# Altium schematic sheet ZUM_Core.SchDoc: ZUM Core
size A4; Author: Andrés Gullón; DocumentNumber: 1; SheetNumber: 1; SheetTotal: 9
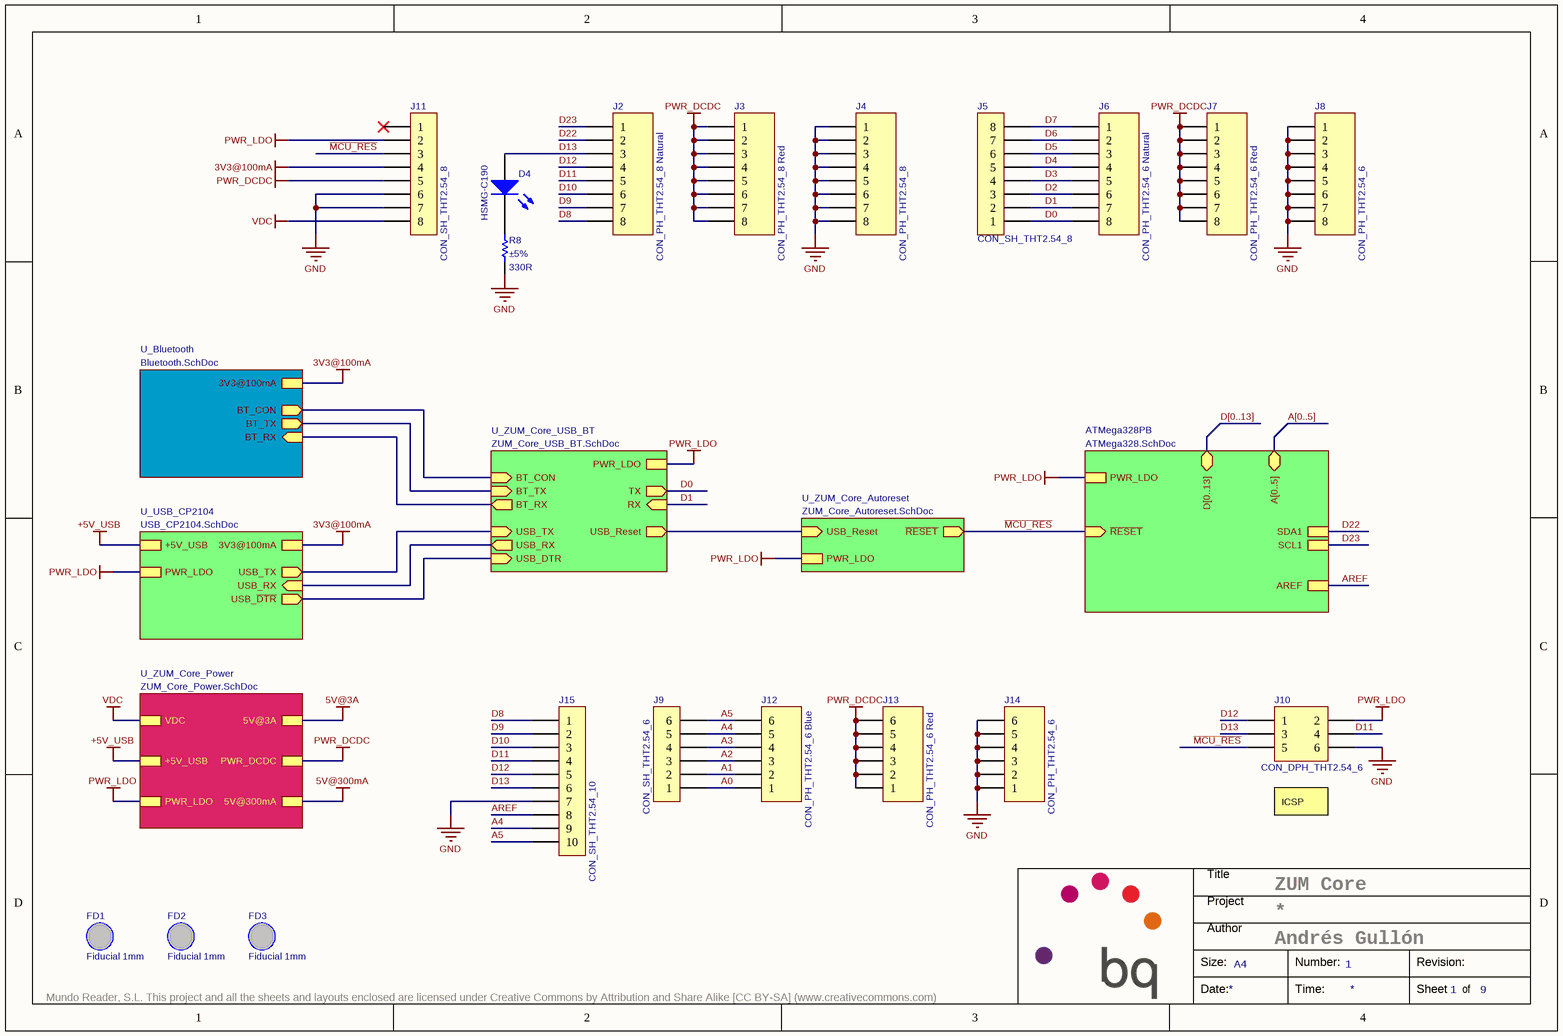
[diagram p0: ZUM_Core.SchDoc]

## Parts
D4  HSMG-C190  [LED0603]
FD1  Fiducial 1mm  [Fiducial_1mm]  (no BOM)
FD2  Fiducial 1mm  [Fiducial_1mm]  (no BOM)
FD3  Fiducial 1mm  [Fiducial_1mm]  (no BOM)
J2  CON_PH_THT2.54_8 Natural  [1x8 Pin Header 2.54]
J3  CON_PH_THT2.54_8 Red  [1x8 Pin Header 2.54]
J4  CON_PH_THT2.54_8  [1x8 Pin Header 2.54]
J5  CON_SH_THT2.54_8  [1x8 Socket Header THT 2.54mm]
J6  CON_PH_THT2.54_6 Natural  [1x8 Header 2.54 (3D Mod)]
J7  CON_PH_THT2.54_6 Red  [1x8 Header 2.54 (3D Mod)]
J8  CON_PH_THT2.54_6  [1x8 Header 2.54 (3D Mod)]
J9  CON_SH_THT2.54_6  [1x6 Socket Header THT 2.54mm]
J10  CON_DPH_THT2.54_6  [2x3 Pin Header 2.54]
J11  CON_SH_THT2.54_8  [1x8 Socket Header THT 2.54mm]
J12  CON_PH_THT2.54_6 Blue  [1x6 Pin Header 2.54]
J13  CON_PH_THT2.54_6 Red  [1x6 Pin Header 2.54]
J14  CON_PH_THT2.54_6  [1x6 Pin Header 2.54]
J15  CON_SH_THT2.54_10  [1x10 Socket Header THT 2.54mm]
R8  Tolerance: ±5%  Resistance: 330R  [R0402]  (hidden comment: R0402_330R_0.063W_±5%)

## Sub-sheets
ATMega328PB = ATMega328.SchDoc: D[0..13] (bidir), A[0..5] (bidir), ~{RESET} (in), PWR_LDO, AREF, SDA1, SCL1
U_Bluetooth = Bluetooth.SchDoc: 3V3@100mA, BT_TX (out), BT_RX (in), BT_CON (out)
U_USB_CP2104 = USB_CP2104.SchDoc: USB_~{DTR} (out), USB_TX (out), USB_RX (in), +5V_USB, 3V3@100mA, PWR_LDO
U_ZUM_Core_Autoreset = ZUM_Core_Autoreset.SchDoc: ~{RESET} (out), USB_Reset (in), PWR_LDO
U_ZUM_Core_Power = ZUM_Core_Power.SchDoc: VDC, 5V@3A, +5V_USB, PWR_DCDC, 5V@300mA, PWR_LDO
U_ZUM_Core_USB_BT = ZUM_Core_USB_BT.SchDoc: TX (out), RX (in), USB_RX (out), BT_RX (out), USB_TX (in), BT_TX (in), USB_DTR (in), BT_CON (in), PWR_LDO, USB_Reset (out)

## Nets
3V3@100mA: J11.4 ; sheet U_USB_CP2104/3V3@100mA, sheet U_Bluetooth/3V3@100mA
5V@3A: sheet U_ZUM_Core_Power/5V@3A
5V@300mA: sheet U_ZUM_Core_Power/5V@300mA
+5V_USB: sheet U_USB_CP2104/+5V_USB, sheet U_ZUM_Core_Power/+5V_USB
GND: J4.1 J4.2 J4.3 J4.4 J4.5 J4.6 J4.7 J4.8 J8.1 J8.2 J8.3 J8.4 J8.5 J8.6 J8.7 J8.8 J10.6 J11.6 J11.7 J14.1 J14.2 J14.3 J14.4 J14.5 J14.6 J15.7 R8.1
PWR_DCDC: J3.1 J3.2 J3.3 J3.4 J3.5 J3.6 J3.7 J3.8 J7.1 J7.2 J7.3 J7.4 J7.5 J7.6 J7.7 J7.8 J11.5 J13.1 J13.2 J13.3 J13.4 J13.5 J13.6 ; sheet U_ZUM_Core_Power/PWR_DCDC
PWR_LDO: J10.2 J11.2 ; sheet ATMega328PB/PWR_LDO, sheet U_USB_CP2104/PWR_LDO, sheet U_ZUM_Core_Power/PWR_LDO, sheet U_ZUM_Core_USB_BT/PWR_LDO, sheet U_ZUM_Core_Autoreset/PWR_LDO
VDC: J11.8 ; sheet U_ZUM_Core_Power/VDC
A0: J9.1 J12.1
A1: J9.2 J12.2
A2: J9.3 J12.3
A3: J9.4 J12.4
A4: J9.5 J12.5 J15.9
A5: J9.6 J12.6 J15.10
AREF: J15.8 ; sheet ATMega328PB/AREF
D0: J5.1 J6.8 ; sheet U_ZUM_Core_USB_BT/TX
D1: J5.2 J6.7 ; sheet U_ZUM_Core_USB_BT/RX
D2: J5.3 J6.6
D3: J5.4 J6.5
D4: J5.5 J6.4
D5: J5.6 J6.3
D6: J5.7 J6.2
D7: J5.8 J6.1
D8: J2.8 J15.1
D9: J2.7 J15.2
D10: J2.6 J15.3
D11: J2.5 J10.4 J15.4
D12: J2.4 J10.1 J15.5
D13: D4.A J2.3 J10.3 J15.6
D22: J2.2 ; sheet ATMega328PB/SDA1
D23: J2.1 ; sheet ATMega328PB/SCL1
~{MCU_RES}: J10.5 J11.3 ; sheet ATMega328PB/~{RESET}, sheet U_ZUM_Core_Autoreset/~{RESET}
NetD4_K: D4.K R8.2
(unnamed): sheet U_USB_CP2104/USB_~{DTR}, sheet U_ZUM_Core_USB_BT/USB_DTR
(unnamed): sheet U_USB_CP2104/USB_TX, sheet U_ZUM_Core_USB_BT/USB_TX
(unnamed): sheet U_USB_CP2104/USB_RX, sheet U_ZUM_Core_USB_BT/USB_RX
(unnamed): sheet U_ZUM_Core_USB_BT/BT_RX, sheet U_Bluetooth/BT_RX
(unnamed): sheet U_ZUM_Core_USB_BT/BT_TX, sheet U_Bluetooth/BT_TX
(unnamed): sheet U_ZUM_Core_USB_BT/BT_CON, sheet U_Bluetooth/BT_CON
(unnamed): sheet U_ZUM_Core_USB_BT/USB_Reset, sheet U_ZUM_Core_Autoreset/USB_Reset

Not connected (* = marked no-connect by the designer): J11 1*

## Buses and harness runs
bus A[0..5] = sheet ATMega328PB/A[0..5]
bus D[0..13] = sheet ATMega328PB/D[0..13]

## Notes on the sheet
- (near J10) ICSP
- Title
- Project
- Size:
- Author
- A4
- Number:
- Revision:
- Mundo Reader, S.L. This project and all the sheets and layouts enclosed are licensed under Creative Commons by Attribution and Share Alike [CC BY-SA] (www.creativecommons.com)
- Date:
- Time:
- Sheet
- of

## Library data of the parts
D4 = CMP-A2544-1: LED; Manufacturer: Avago Technologies; Temp_ Max: 85; Temp_ Min: -40; OrderingCode 2: LG Q971-KN-1; Value: Green; SchLibComponentName: LED; Part Number: HSMG-C190; OrderingCode: HSMG-C190; Description ES: LED; Price units: EUR; Manufacturer 2: OSRAM Opto
FD1-FD3 = CMP-A2525-2: Fiducial; Description ES: Marca fiducial; SchLibComponentName: Fiducial; Part Number: Fiducial 1mm
J2 = CMP-A2144-1: Connector; Manufacturer: Samtec; SchLibComponentName: 1x8 pin Header 2.54mm; Pitch: 2.54mm; OrderingCode: TSW-108-07-T-S-NATURAL; Description ES: Conector; Temp_ Max: 105; Temp_ Min: -55; Part Number: CON_PH_THT2.54_8 Natural; Supplier: Samtec; Supplier cod: AC1238; Price units: EUR
J3 = CMP-A2145-1: Connector; Manufacturer: Samtec; SchLibComponentName: 1x8 pin Header 2.54mm; Pitch: 2.54mm; OrderingCode: TSW-108-07-T-S-RED; Description ES: Conector; Temp_ Max: 105; Temp_ Min: -55; Part Number: CON_PH_THT2.54_8 Red; Supplier: Samtec; Supplier cod: AC1238; Price units: EUR
J4 = CMP-A2142-1: Connector; Manufacturer: Samtec; SchLibComponentName: 1x8 pin Header 2.54mm; Pitch: 2.54mm; OrderingCode: TSW-108-07-T-S; Description ES: Conector; Temp_ Max: 105; Temp_ Min: -55; OrderingCode 2: 613 008 111 21; Value: 8; Part Number: CON_PH_THT2.54_8; Supplier: Samtec; Supplier cod: AC1238; Price units: EUR; Manufacturer 2: Würth Elektronik
J5 J11 = CMP-A2195-1: Connector; Manufacturer: Samtec; Pitch: 2.54mm; OrderingCode: SSW-108-01-T-S; Description ES: Conector; Temp_ Max: 125; Temp_ Min: -40; OrderingCode 2: 613 008 118 21; Value: 8; SchLibComponentName: 1x8 Socket Header 2.54mm; Part Number: CON_SH_THT2.54_8; Supplier: Samtec; Supplier cod: AC1238; Price units: EUR; Manufacturer 2: Würth Elektronik
J6 = CMP-00382-1: Connector; Manufacturer: Samtec; SchLibComponentName: 1x6 pin Header 2.54mm; Pitch: 2.54mm; OrderingCode: TSW-106-07-T-S-NATURAL; Description ES: Conector; Temp_ Max: 105; Temp_ Min: -55; Part Number: CON_PH_THT2.54_6 Natural; Supplier: Samtec; Supplier cod: AC1238; Price units: EUR
J7 = CMP-00380-2: Connector; Manufacturer: Samtec; SchLibComponentName: 1x6 pin Header 2.54mm; Pitch: 2.54mm; OrderingCode: TSW-106-07-T-S-RED; Description ES: Conector; Temp_ Max: 105; Temp_ Min: -55; Part Number: CON_PH_THT2.54_6 Red; Supplier: Samtec; Supplier cod: AC1238; Price units: EUR
J8 = CMP-00381-1: Connector; Manufacturer: Samtec; SchLibComponentName: 1x6 pin Header 2.54mm; Pitch: 2.54mm; OrderingCode: TSW-106-07-T-S; Description ES: Conector; Temp_ Max: 105; Temp_ Min: -55; OrderingCode 2: 613 006 111 21; Value: 6; Part Number: CON_PH_THT2.54_6; Supplier: Samtec; Supplier cod: AC1238; Price units: EUR; Manufacturer 2: Würth Elektronik
J9 = CMP-A2194-1: Connector; Manufacturer: Samtec; Pitch: 2.54mm; OrderingCode: SSW-106-01-T-S; Description ES: Conector; Temp_ Max: 125; Temp_ Min: -40; OrderingCode 2: 613 006 118 21; Value: 6; SchLibComponentName: 1x6 Socket Header 2.54mm; Part Number: CON_SH_THT2.54_6; Supplier: Samtec; Supplier cod: AC1238; Price units: EUR; Manufacturer 2: Würth Elektronik
J10 = CMP-A2163-1: Connector; Manufacturer: Samtec; SchLibComponentName: 2x3 pin Header 2.54mm; Pitch: 2.54mm; OrderingCode: TSW-103-07-T-D; Description ES: Conector; Temp_ Max: 125; Temp_ Min: -40; OrderingCode 2: 613 006 211 21; Value: 6; Part Number: CON_DPH_THT2.54_6; Supplier: Samtec; Supplier cod: AC1238; Price units: EUR; Manufacturer 2: Würth Elektronik
J12 = CMP-A2139-1: Connector; Manufacturer: Samtec; SchLibComponentName: 1x6 pin Header 2.54mm; Pitch: 2.54mm; OrderingCode: TSW-106-07-T-S-BLUE; Description ES: Conector; Temp_ Max: 105; Temp_ Min: -55; Part Number: CON_PH_THT2.54_6 Blue; Supplier: Samtec; Supplier cod: AC1238; Price units: EUR
J13 = CMP-A2141-1: Connector; Manufacturer: Samtec; SchLibComponentName: 1x6 pin Header 2.54mm; Pitch: 2.54mm; OrderingCode: TSW-106-07-T-S-RED; Description ES: Conector; Temp_ Max: 105; Temp_ Min: -55; Part Number: CON_PH_THT2.54_6 Red; Supplier: Samtec; Supplier cod: AC1238; Price units: EUR
J14 = CMP-A2138-1: Connector; Manufacturer: Samtec; SchLibComponentName: 1x6 pin Header 2.54mm; Pitch: 2.54mm; OrderingCode: TSW-106-07-T-S; Description ES: Conector; Temp_ Max: 105; Temp_ Min: -55; OrderingCode 2: 613 006 111 21; Value: 6; Part Number: CON_PH_THT2.54_6; Supplier: Samtec; Supplier cod: AC1238; Price units: EUR; Manufacturer 2: Würth Elektronik
J15 = CMP-A2189-1: Connector; Manufacturer: Samtec; Pitch: 2.54mm; OrderingCode: SSW-110-01-T-S; Description ES: Conector; Temp_ Max: 125; Temp_ Min: -40; Value: 10; OrderingCode 2: 613 010 118 21; SchLibComponentName: 1x10 Socket Header 2.54mm; Part Number: CON_SH_THT2.54_10; Supplier: Samtec; Supplier cod: AC1238; Price units: EUR; Manufacturer 2: Würth Elektronik
R8 = CMP-A1762-2: Manufacturer: Vishay; SchLibComponentName: Resistor; OrderingCode: CRCW0402330RJN; Power: 0.063W; Value: 330R ±5% 0.063W; Temp_ Max: 155; Temp_ Min: -55; Description ES: Resistencia; PackageDescription: SMD; Part Number: R0402_330R_0.063W_±5%; Price units: EUR